# EAGLE design tl494module_1 (EAGLE 8.3.1)
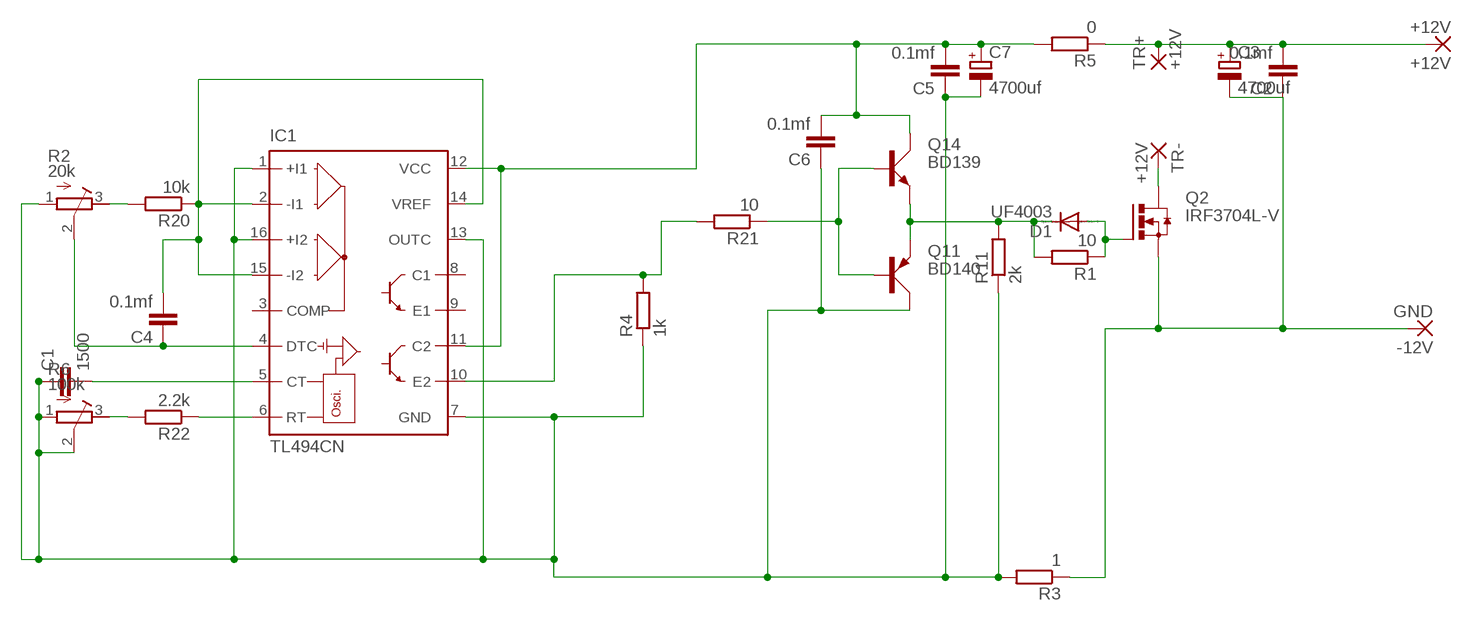
[diagram p0: schematic, sheet 1]

## Parts
+12V  +12V  3,81/1,1  [3,81/1,1]
-12V  GND  3,81/1,1  [3,81/1,1]
C1  1500  C-EU050-025X075  [C050-025X075]
C2  0.1mf  C-EU050-025X075  [C050-025X075]
C3  4700uf  CPOL-EUE7.5-16  [E7,5-16]
C4  0.1mf  C-EU050-025X075  [C050-025X075]
C5  0.1mf  C-EU050-025X075  [C050-025X075]
C6  0.1mf  C-EU050-025X075  [C050-025X075]
C7  4700uf  CPOL-EUE7.5-16  [E7,5-16]
D1  UF4003  [DO41-10]
IC1  TL494CN  [DIL16]
Q2  IRF3704L-V  [TO262-V]
Q11  BD140  [TO126AV]
Q14  BD139  [TO126AV]
R1  10  R-EU_0204/7  [0204/7]
R2  20k  R-TRIMM3296W  [RTRIM3296W]
R3  1  R-EU_0204/7  [0204/7]
R4  1k  R-EU_0204/7  [0204/7]
R5  0  R-EU_0204/7  [0204/7]
R6  100k  R-TRIMM3296W  [RTRIM3296W]
R11  2k  R-EU_0204/7  [0204/7]
R20  10k  R-EU_0204/7  [0204/7]
R21  10  R-EU_0204/7  [0204/7]
R22  2.2k  R-EU_0204/7  [0204/7]
TR+  +12V  3,81/1,1  [3,81/1,1]
TR-  +12V  3,81/1,1  [3,81/1,1]

## Nets
GND: -12V.1(P) C2.1 C3.- Q2.3(S) R3.1
GND1: C1.1 C5.1 C6.1 C7.- IC1.1(+I1) IC1.7(GND) IC1.13(OUTC) IC1.16(+I2) Q11.C R2.1(A) R3.2 R4.1 R6.1(A) R6.2(S) R11.1
N$1: IC1.6(RT) R22.1
N$2: C1.2 IC1.5(CT)
N$3: R2.3(E) R20.2
N$4: +12V.1(P) C2.2 C3.+ R5.1 TR+.1(P)
N$5: C4.1 IC1.4(DTC) R2.2(S)
N$6: IC1.10(E2) R4.2 R21.2
N$7: R6.3(E) R22.2
N$8: C5.2 C6.2 C7.+ IC1.11(C2) IC1.12(VCC) Q14.C R5.2
N$9: Q2.2(D) TR-.1(P)
N$11: C4.2 IC1.2(-I1) IC1.14(VREF) IC1.15(-I2) R20.1
N$12: D1.C Q11.E Q14.E R1.2 R11.2
N$13: D1.A Q2.1(G) R1.1
N$26: Q11.B Q14.B R21.1
Unconnected: IC1.3(COMP) IC1.8(C1) IC1.9(E1)

## Library data of the parts
+12V -12V TR+ TR- = wirepad:3,81/1,1: THROUGH-HOLE PAD
C1 C2 C4-C6 = resistor:C-EU: CAPACITOR, European symbol
C3 C7 = resistor:CPOL-EU: POLARIZED CAPACITOR, European symbol
D1 = diode:UF4003: DIODE ultrafast recovery diode, 200 V rectifier
IC1 = linear:TL494*: SWITCHMODE Pulse Width Modulation Control Circuit NCV494B http://onsemi.com tl494-d.pdf
Q2 = transistor-power:IRF3704: SMPS MOSFET HEXFET® Power MOSFET Source: http://www.irf.com/product-info/datasheets/data/irf3704.pdf
Q11 = transistor-power:BD140: PNP TRANSISTOR
Q14 = transistor-power:BD139: NPN TRANSISTOR
R1 R3-R5 R11 R20-R22 = resistor:R-EU_: RESISTOR, European symbol
R2 R6 = resistor:R-TRIMM: Trimm resistor

## Board
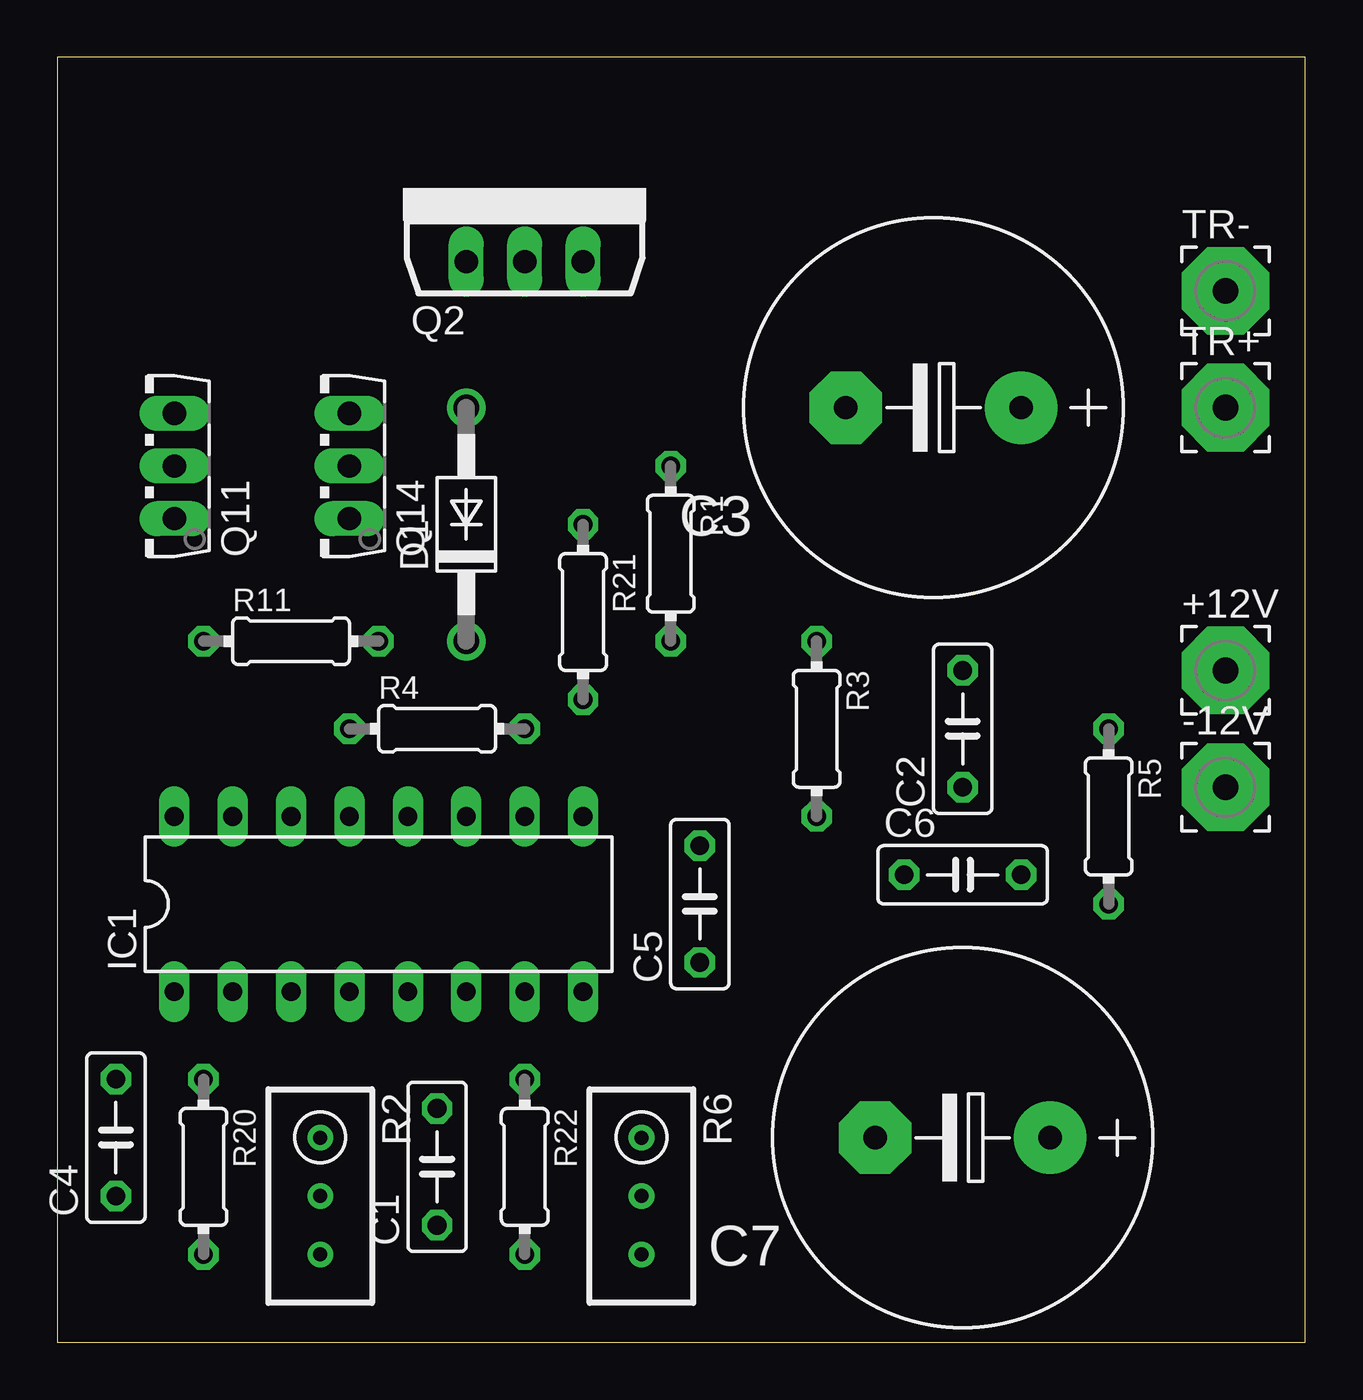
[diagram p1: board, top side]
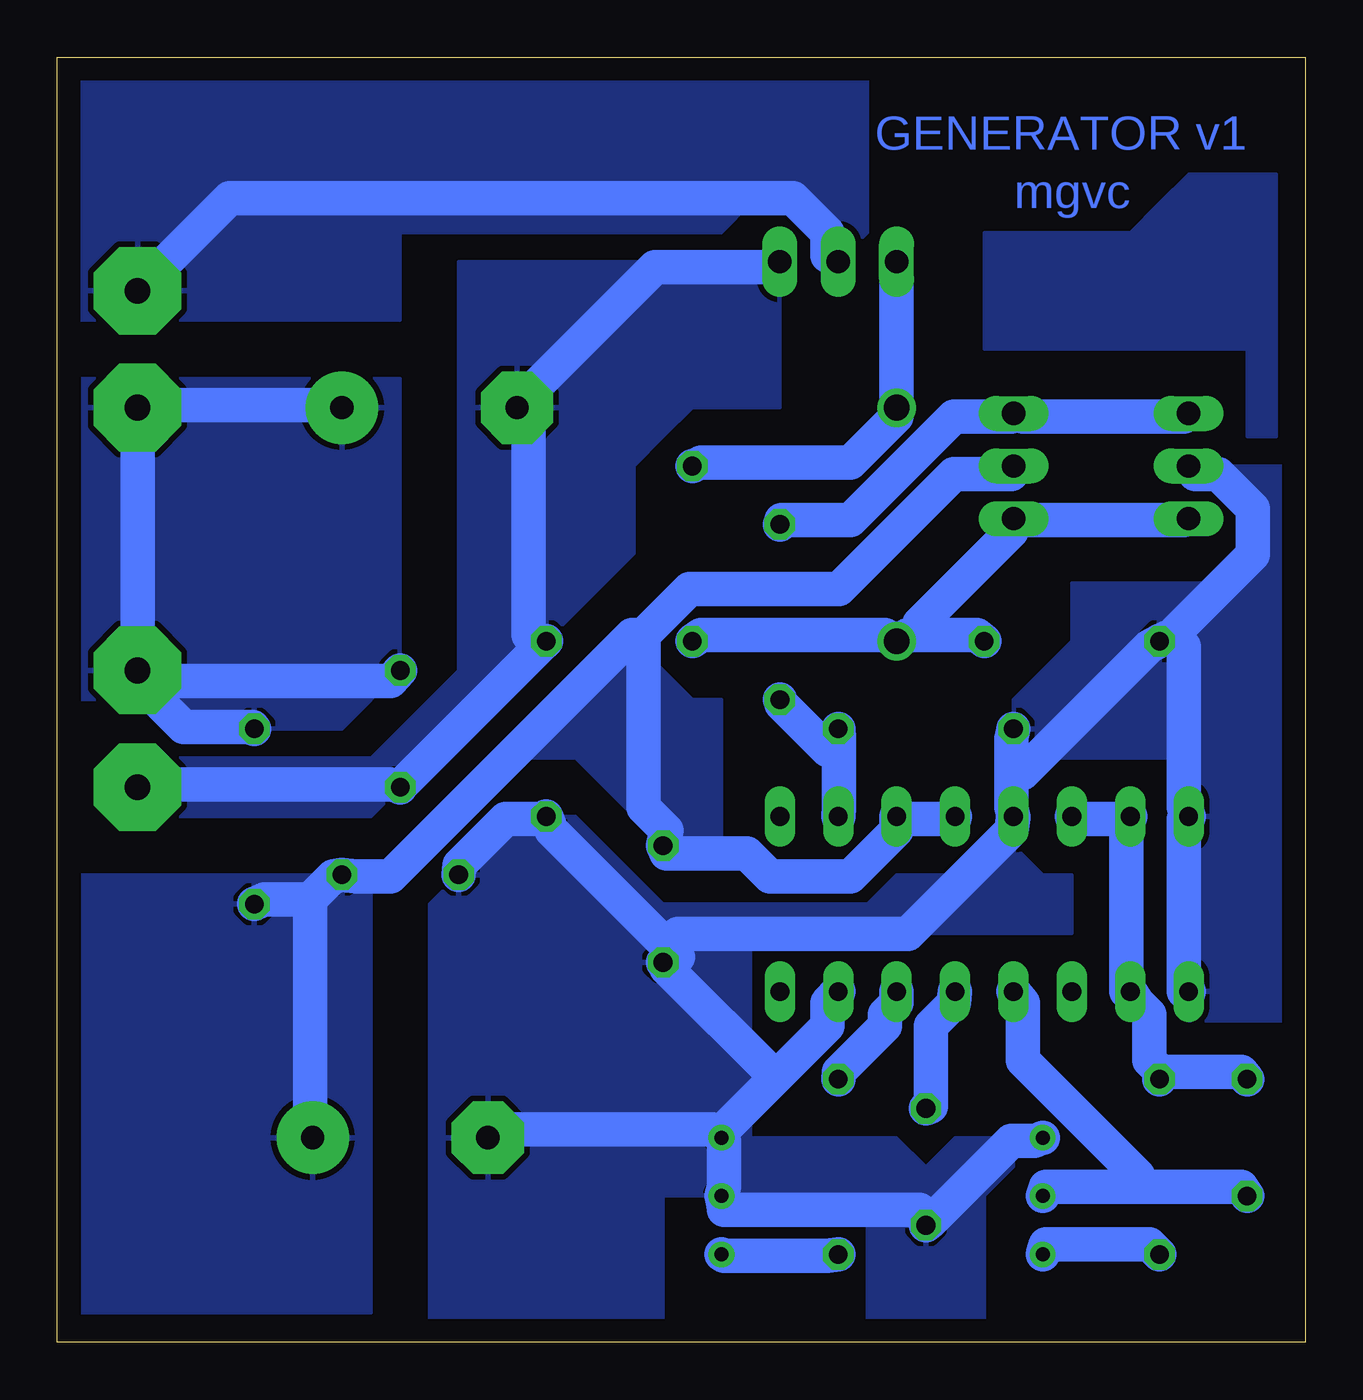
[diagram p2: board, bottom side, seen from below]

Size 54.28 x 55.87 mm. Coordinates in mm from the lower left corner, seen from the top.
Outline: 0,0 54.28,0 54.28,55.87 0,55.87 0,0
Copper layers (1*16): Top 0.035mm / dielectric 1.5mm / Bottom 0.035mm
Design rules "default *": minimum track width 1.5mm, minimum drill 0.35mm, track to track 6mil, track to pad 6mil, pad to pad 6mil, via to via 6mil, smd to smd 6mil, copper to edge 40mil, drill to drill 6mil, minimum pad ring 10mil, minimum via ring 8mil, stop-mask expansion 4mil, vias tented up to drill 0mil, thermal gap 10mil

### Footprints (pad centres in the part's own frame; a part is rotated, then mirrored left to right if it is on the bottom)
3,81/1,1 = drill 1.118 pad 3.81 octagon: 1 0,0
C050-025X075 = drill 0.813 octagon: 1 -2.54,0; 2 2.54,0
E7,5-16 = drill 1.016 pad 3.15: + -3.81,0 | drill 1.016 pad 3.15 octagon: - 3.81,0
DO41-10 = drill 1.118: A 5.08,0; C -5.08,0
DIL16 = drill 0.813 long: 1 -8.89,-3.81; 2 -6.35,-3.81; 3 -3.81,-3.81; 4 -1.27,-3.81; 5 1.27,-3.81; 6 3.81,-3.81; 7 6.35,-3.81; 8 8.89,-3.81; 9 8.89,3.81; 10 6.35,3.81; 11 3.81,3.81; 12 1.27,3.81; 13 -1.27,3.81; 14 -3.81,3.81; 15 -6.35,3.81; 16 -8.89,3.81
TO262-V = drill 1.016 long: 1 -2.54,0; 2 0,0; 3 2.54,0
TO126AV = drill 1.016 long: B 2.286,-1.27; C 0,-1.27; E -2.286,-1.27
0204/7 = drill 0.813 octagon: 1 -3.81,0; 2 3.81,0
RTRIM3296W = drill 0.61: 1 0,-2.54; 2 0,0; 3 0,2.54

### Placement (x,y rotation side)
+12V  50.8,29.21 0 top
-12V  50.8,24.13 0 top
C1  1000  [C050-025X075]  16.51,7.62 90 top
C2  39.37,26.67 90 top
C3  38.1,40.64 180 top
C4  2.54,8.89 90 top
C5  27.94,19.05 90 top
C6  39.37,20.32 0 top
C7  39.37,8.89 180 top
D1  17.78,35.56 90 top
IC1  13.97,19.05 0 top
Q2  20.32,46.99 0 top
Q11  3.81,38.1 90 top
Q14  11.43,38.1 90 top
R1  22  [0204/7]  26.67,34.29 270 top
R2  11.43,6.35 180 top
R3  10(?)  [0204/7]  33.02,26.67 270 top
R4  16.51,26.67 0 top
R5  45.72,22.86 270 top
R6  330k  [RTRIM3296W]  25.4,6.35 180 top
R11  10.16,30.48 0 top
R20  12k  [0204/7]  6.35,7.62 270 top
R21  39  [0204/7]  22.86,31.75 270 top
R22  20.32,7.62 270 top
TR+  50.8,40.64 0 top
TR-  50.8,45.72 0 top

### Tracks (layer width: path | path; a pad name or v marks a point on that pad's centre or on a via)
GND
  Bottom 1.5: 33.29,30.26 39.29,24.26 C2.1 39.79,24.26 50.79,24.26 -12V.1 | 33.29,30.26 R3.1 | Q2.3 23.29,46.76 28.29,46.76 34.29,40.76 C3.- 33.79,40.26 33.79,30.76 33.29,30.26
  pour Bottom: 22.86,46.99 22.86,40.64 26.67,40.64 27.94,39.37 29.21,38.1 29.21,34.29 39.37,24.13 40.64,22.86 50.8,22.86 50.8,25.4 40.64,25.4 36.83,29.21 36.83,46.99
GND1
  Bottom 1.5: IC1.1 5.29,15.26 5.29,22.76 IC1.16 5.29,23.26 5.29,30.26 5.79,30.76 | 12.79,24.76 12.79,26.26 R4.1 | 12.79,24.76 12.79,23.26 IC1.13 12.79,22.26 17.29,17.76 27.29,17.76 27.79,17.26 | 12.79,24.76 12.29,24.76 6.79,30.26 R11.1 5.79,30.76 | 5.79,30.76 2.29,34.26 2.29,36.26 3.79,37.76 4.79,37.76 Q11.C | 16.29,5.26 12.79,8.76 11.79,8.76 R2.1 | 16.29,5.26 C1.1 | C6.1 36.79,20.76 34.79,22.76 33.29,22.76 R3.2 32.79,22.26 27.79,17.26 | R6.1 25.29,8.76 25.29,6.76 R6.2 25.29,5.76 16.79,5.76 16.29,5.26 | 23.04,11.51 25.29,9.26 R6.1 | 23.04,11.51 20.79,13.76 20.79,14.76 IC1.7 | 23.04,11.51 27.79,16.26 C5.1 27.29,16.76 27.79,17.26 | C7.- 35.29,9.26 25.79,9.26 R6.1
  pour Bottom: 5.08,38.1 0,38.1 0,13.97 5.08,13.97 5.08,25.4 12.7,25.4 12.7,27.94 10.16,30.48 10.16,33.02 3.81,33.02 2.54,34.29 2.54,36.83 3.81,36.83
  pour Bottom: 12.7,21.59 11.43,20.32 10.16,20.32 10.16,17.78 19.05,17.78 19.05,19.05 17.78,20.32 15.24,20.32 13.97,21.59
  pour Bottom: 12.7,8.89 12.7,7.62 13.97,6.35 13.97,0 19.05,0 19.05,6.35 27.94,6.35 27.94,0 38.1,0 38.1,19.05 34.29,22.86 31.75,22.86 27.94,19.05 19.05,19.05 19.05,17.78 24.13,17.78 24.13,10.16 24.13,8.89 17.78,8.89 16.51,7.62 15.24,8.89
N$1
  Bottom 1.5: R22.1 20.29,11.76 18.29,13.76 18.29,14.26 17.79,14.76 IC1.6
N$2
  Bottom 1.5: C1.2 16.29,10.26 16.29,13.76 15.29,14.76 IC1.5
N$3
  Bottom 1.5: R2.3 11.29,4.26 6.79,4.26 R20.2
N$4
  Bottom 1.5: R5.1 45.79,26.76 48.79,26.76 50.79,28.76 +12V.1 | C2.2 39.79,28.76 49.79,28.76 +12V.1 | C3.+ 42.29,40.76 50.79,40.76 TR+.1 50.79,40.26 50.79,29.76 +12V.1
  pour Bottom: 53.34,41.91 39.37,41.91 39.37,29.21 41.91,26.67 49.53,26.67 50.8,27.94 53.34,27.94
N$5
  Bottom 1.5: 7.29,6.76 2.79,6.76 C4.1 | 7.29,6.76 11.29,6.76 R2.2 | IC1.4 12.29,14.76 12.29,12.26 7.29,7.26 7.29,6.76
N$6
  Bottom 1.5: 20.29,25.76 20.29,26.26 R4.2 | 20.29,25.76 20.29,23.26 IC1.10 | R21.2 22.79,27.76 20.79,25.76 20.29,25.76
N$7
  Bottom 1.5: R6.3 25.29,3.76 20.79,3.76 R22.2
N$8
  Bottom 1.5: 43.29,19.26 45.29,19.26 R5.2 | 43.29,19.26 42.29,20.26 C6.2 41.29,20.26 39.79,20.26 29.29,30.76 28.79,30.76 | 43.29,19.26 43.29,9.26 C7.+ | IC1.12 15.29,22.76 17.29,22.76 IC1.11 17.79,22.26 19.79,20.26 23.29,20.26 24.29,21.26 27.79,21.26 C5.2 27.79,22.26 28.79,23.26 28.79,30.76 | 28.79,30.76 26.79,32.76 20.29,32.76 15.29,37.76 12.79,37.76 Q14.C
  pour Bottom: 41.91,1.27 53.34,1.27 53.34,20.32 40.64,20.32 40.64,1.27
  pour Bottom: 25.4,21.59 25.4,27.94 26.67,27.94 29.21,30.48 34.29,25.4 31.75,25.4 27.94,21.59
N$9
  Bottom 1.5: Q2.2 20.79,47.26 20.79,48.26 22.29,49.76 46.79,49.76 50.79,45.76 TR-.1
  pour Bottom: 20.32,46.99 19.05,48.26 19.05,55.88 54.61,55.88 54.61,44.45 39.37,44.45 39.37,48.26 25.4,48.26 24.13,49.53 21.59,49.53 21.59,48.26
N$10
  pour Bottom: 13.97,48.26 7.62,48.26 6.35,49.53 5.08,50.8 1.27,50.8 1.27,39.37 2.54,39.37 2.54,43.18 13.97,43.18
N$11
  Bottom 1.5: 6.29,11.76 2.79,11.76 C4.2 | 6.29,11.76 R20.1 | 7.79,22.76 7.79,15.26 IC1.2 7.29,14.76 6.79,14.26 6.79,12.26 6.29,11.76 | 7.79,22.76 IC1.15 | 7.79,22.76 9.79,22.76 IC1.14
N$12
  Bottom 1.5: Q11.E 5.29,35.76 12.29,35.76 Q14.E 12.79,35.26 16.79,31.26 16.79,30.76 | 16.79,30.76 17.29,30.76 D1.C 18.29,30.76 26.29,30.76 R1.2 | 16.79,30.76 14.29,30.76 R11.2
N$13
  Bottom 1.5: R1.1 26.29,38.26 19.79,38.26 17.79,40.26 D1.A 17.79,41.26 17.79,46.76 Q2.1
N$26
  Bottom 1.5: R21.1 22.79,35.76 19.79,35.76 15.29,40.26 12.79,40.26 Q14.B 12.29,40.26 5.29,40.26 Q11.B

### Text on the board
Bottom: GENERATOR v1 | mgvc